# EAGLE design M_H_ext_disp (EAGLE 9.6.2)
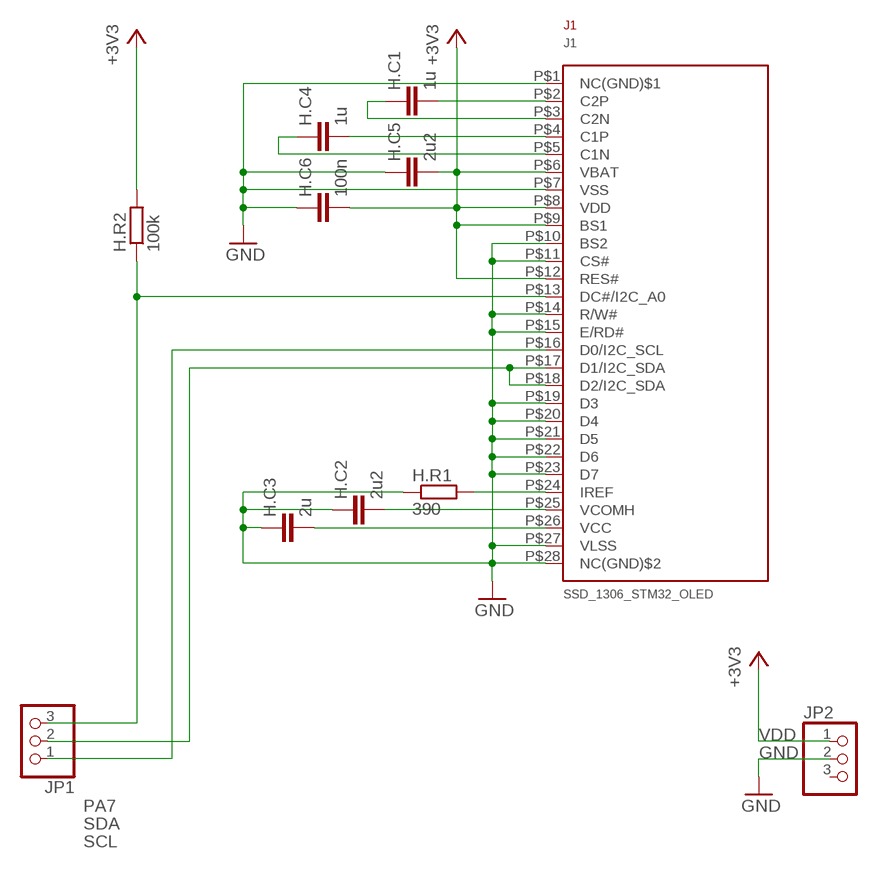
[diagram p0: schematic, sheet 1]

## Parts
H.C1  1u  C-EUC0603  [C0603]
H.C2  2u2  C-EUC0603  [C0603]
H.C3  2u  C-EUC0603  [C0603]
H.C4  1u  C-EUC0603  [C0603]
H.C5  2u2  C-EUC0603  [C0603]
H.C6  100n  C-EUC0603  [C0603]
H.R1  390  R-EU_R0603  [R0603]
H.R2  100k  R-EU_R0603  [R0603]
J1  SSD_1306_STM32_OLED  [SSD_1306_STM32_OLED]
JP1  PINHD-1X3  [1X03]
JP2  PINHD-1X3  [1X03]

## Nets
GND: H.C2.1 H.C3.1 H.C5.1 H.C6.1 H.R1.1 J1.P$1(NC(GND)$1) J1.P$7(VSS) J1.P$10(BS2) J1.P$11(CS#) J1.P$14(R/W#) J1.P$15(E/RD#) J1.P$19(D3) J1.P$20(D4) J1.P$21(D5) J1.P$22(D6) J1.P$23(D7) J1.P$27(VLSS) J1.P$28(NC(GND)$2) JP2.2
N$1: H.R1.2 J1.P$24(IREF)
N$3: H.C3.2 J1.P$26(VCC)
N$5: H.C2.2 J1.P$25(VCOMH)
N$7: H.C1.2 J1.P$2(C2P)
N$8: H.C1.1 J1.P$3(C2N)
N$9: H.C4.2 J1.P$4(C1P)
N$10: H.C4.1 J1.P$5(C1N)
PA7: H.R2.1 J1.P$13(DC#/I2C_A0) JP1.3
SCL: J1.P$16(D0/I2C_SCL) JP1.1
SDA: J1.P$17(D1/I2C_SDA) J1.P$18(D2/I2C_SDA) JP1.2
VDD: H.C5.2 H.C6.2 H.R2.2 J1.P$6(VBAT) J1.P$8(VDD) J1.P$9(BS1) J1.P$12(RES#) JP2.1 ; supply symbol labelled +3V3
Unconnected: JP2.3

## Library data of the parts
H.C1-H.C6 = rcl:C-EU: CAPACITOR, European symbol; SPICEPREFIX: C
H.R1 H.R2 = rcl:R-EU_: RESISTOR, European symbol; SPICEPREFIX: R
J1 = hugo:SSD_1306_STM32_OLED
JP1 JP2 = pinhead2:PINHD-1X3: PIN HEADER

## Board
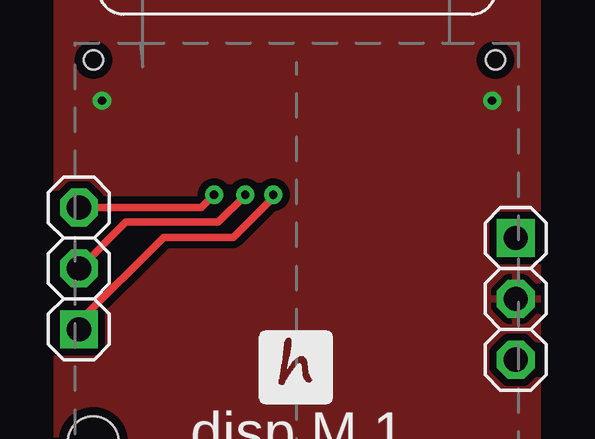
[diagram p1: board, top side]
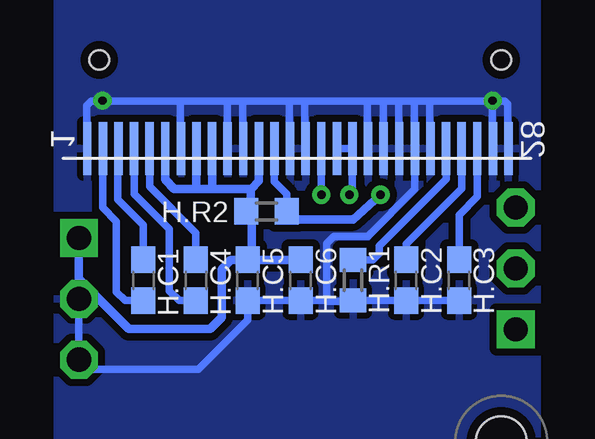
[diagram p2: board, bottom side, seen from below]

No outline drawn. Coordinates in mm, seen from the top.
Copper layers (1*16): Top 0.035mm / dielectric 1.5mm / Bottom 0.035mm
Design rules "default *": minimum track width 12mil, minimum drill 0.35mm, track to track 12mil, track to pad 12mil, pad to pad 12mil, via to via 12mil, smd to smd 12mil, copper to edge 15mil, drill to drill 15mil, minimum pad ring 10mil, minimum via ring 8mil, stop-mask expansion 4mil, vias tented up to drill 0mil, thermal gap 10mil
Holes 2.1 mm at 2,2

### Footprints (pad centres in the part's own frame; a part is rotated, then mirrored left to right if it is on the bottom)
C0603 = smd 1.1 x 1: 1 -0.85,0; 2 0.85,0
R0603 = smd 1 x 1.1: 1 -0.85,0; 2 0.85,0
SSD_1306_STM32_OLED = smd 0.35 x 2.2 bottom: P$1 0,-0.4; P$2 0.65,-0.4; P$3 1.3,-0.4; P$4 1.95,-0.4; P$5 2.6,-0.4; P$6 3.25,-0.4; P$7 3.9,-0.4; P$8 4.55,-0.4; P$9 5.2,-0.4; P$10 5.85,-0.4; P$11 6.5,-0.4; P$12 7.15,-0.4; P$13 7.8,-0.4; P$14 8.45,-0.4; P$15 9.1,-0.4; P$16 9.75,-0.4; P$17 10.4,-0.4; P$18 11.05,-0.4; P$19 11.7,-0.4; P$20 12.35,-0.4; P$21 13,-0.4; P$22 13.65,-0.4; P$23 14.3,-0.4; P$24 14.95,-0.4; P$25 15.6,-0.4; P$26 16.25,-0.4; P$27 16.9,-0.4; P$28 17.55,-0.4 | hole 0.8: 0.5,-4.1; 17.25,-4.1
1X03 = drill 1.016 pad 1.575 square: 1 -2.54,0 | drill 1.016 pad 1.575 octagon: 2 0,0; 3 2.54,0

### Placement (x,y rotation side)
H.C1  16.92,8.74 270 bottom
H.C2  5.97,8.74 90 bottom
H.C3  3.76,8.74 90 bottom
H.C4  14.73,8.74 270 bottom
H.C5  12.57,8.74 90 bottom
H.C6  10.36,8.74 90 bottom
H.R1  8.18,8.74 90 bottom
H.R2  11.79,11.61 180 bottom
J1  19.25,13.83 180 top
JP1  1.4,9.23 90 top
JP2  19.6,7.96 270 top

### Tracks (layer width: path | path; a pad name or v marks a point on that pad's centre or on a via)
GND  (via drill 0.35)
  Bottom 0.305: J1.P$28 1.73,14.25 1.73,16.08 1.87,16.22 2.36,16.22 | J1.P$1 19.28,14.25 19.28,16.03 19.09,16.22 15.37,16.22 | 15.37,16.22 13.41,16.22 | 13.41,16.22 12.72,16.22 | 12.72,16.22 10.79,16.22 | 10.79,16.22 10.19,16.22 | 6.93,16.22 7.52,16.22 7.58,16.16 | 6.93,16.22 6.27,16.22 | 6.27,16.22 5.69,16.22 | 5.69,16.22 5,16.22 | 5,16.22 2.36,16.22 | J1.P$27 2.38,14.25 2.38,16.2 2.36,16.22 | J1.P$23 4.98,14.25 4.98,16.19 5,16.22 | 5.69,16.22 5.63,16.16 5.63,14.25 J1.P$22 5.6,12.53 7.57,10.57 8.98,10.57 9.27,10.28 9.27,7.89 | J1.P$21 6.28,14.25 6.28,16.21 6.27,16.22 | J1.P$20 6.93,14.25 6.93,16.21 6.93,16.22 | 7.58,16.16 7.58,14.25 J1.P$19 | J1.P$15 10.19,14.26 10.19,16.22 | J1.P$14 10.83,14.25 10.83,16.18 10.79,16.22 | J1.P$11 12.78,14.25 12.78,16.16 12.72,16.22 | J1.P$10 13.43,14.25 13.43,16.2 13.41,16.22 | J1.P$7 15.38,14.25 15.38,16.21 15.37,16.22 | 8.37,7.86 9.27,7.86 9.27,7.89 | 9.27,7.89 H.C6.1 H.C5.1 12.57,7.08 14.63,5.01 19.09,5.01 19.6,5.52 JP2.2 | H.R1.1 H.C2.1 H.C3.1 | 7.58,16.16 7.58,16.22 10.19,16.22
  other vias: 2.36,16.23 18.62,16.23
  pour Top (isolate 0.305): 0.5,20.5 0.5,0.5 20.5,0.5 20.5,20.5
  pour Bottom (isolate 0.305): 0.5,0.5 20.5,0.5 20.5,20.5 0.5,20.5
N$1
  Bottom 0.305: J1.P$24 4.3,12.95 7.08,10.18 7.08,9.86 7.35,9.59 H.R1.2
N$3
  Bottom 0.305: J1.P$26 3,12.22 3.76,11.47 H.C3.2
N$5
  Bottom 0.305: J1.P$25 3.65,12.56 5.97,10.25 H.C2.2
N$7
  Bottom 0.305: 16.64,8.04 16.79,7.89 H.C1.2 17.67,7.89 18.03,8.26 18.03,11.2 18.6,11.76 J1.P$2
N$8
  Bottom 0.305: J1.P$3 17.98,14.2 17.98,12.1 16.92,11.04 H.C1.1
N$9
  Bottom 0.305: H.C4.2 15.43,7.89 15.83,8.29 15.83,10.87 17.3,12.34 J1.P$4
N$10
  Bottom 0.305: J1.P$5 16.65,12.64 14.73,10.72 H.C4.1
PA7  (via drill 0.35)
  Top 0.305: JP1.3 6.49,11.77 v7.04,12.3
  Bottom 0.305: H.R2.1 10.94,12.33 11.45,12.85 J1.P$13
  Bottom 0.356: v7.04,12.3 8.17,11.28 10.61,11.28 H.R2.1
SCL  (via drill 0.35)
  Top 0.305: JP1.1 1.4,7 4.93,10.53 7.83,10.53 9.5,12.2 v9.5,12.3
  Bottom 0.305: J1.P$16 9.5,12.41 v9.5,12.3
SDA  (via drill 0.35)
  Top 0.305: JP1.2 1.43,9.23 3.36,11.16 7.2,11.16 8.33,12.28 v8.33,12.3
  Bottom 0.305: J1.P$17 J1.P$18 8.2,12.43 v8.33,12.3
VDD
  Bottom 0.356: J1.P$6 16,12.93 15.62,12.55 14.73,12.55 | J1.P$12 12.1,12.87 12.42,12.55 12.43,12.55 | 12.43,12.55 14.05,12.55 | 14.05,12.55 14.73,12.55 | J1.P$9 14.05,12.55 | J1.P$8 14.7,12.58 14.73,12.55 | 12.43,12.55 12.43,11.81 H.R2.2 12.39,11.37 12.39,9.77 H.C5.2 | H.C5.2 H.C6.2 | H.C5.2 13.27,9.59 13.66,9.2 13.66,7.18 14.13,6.7 17.52,6.7 19.6,8.79 JP2.1

### Text on the board
tPlace: disp M.1